# EAGLE design MINI (EAGLE 6.1)
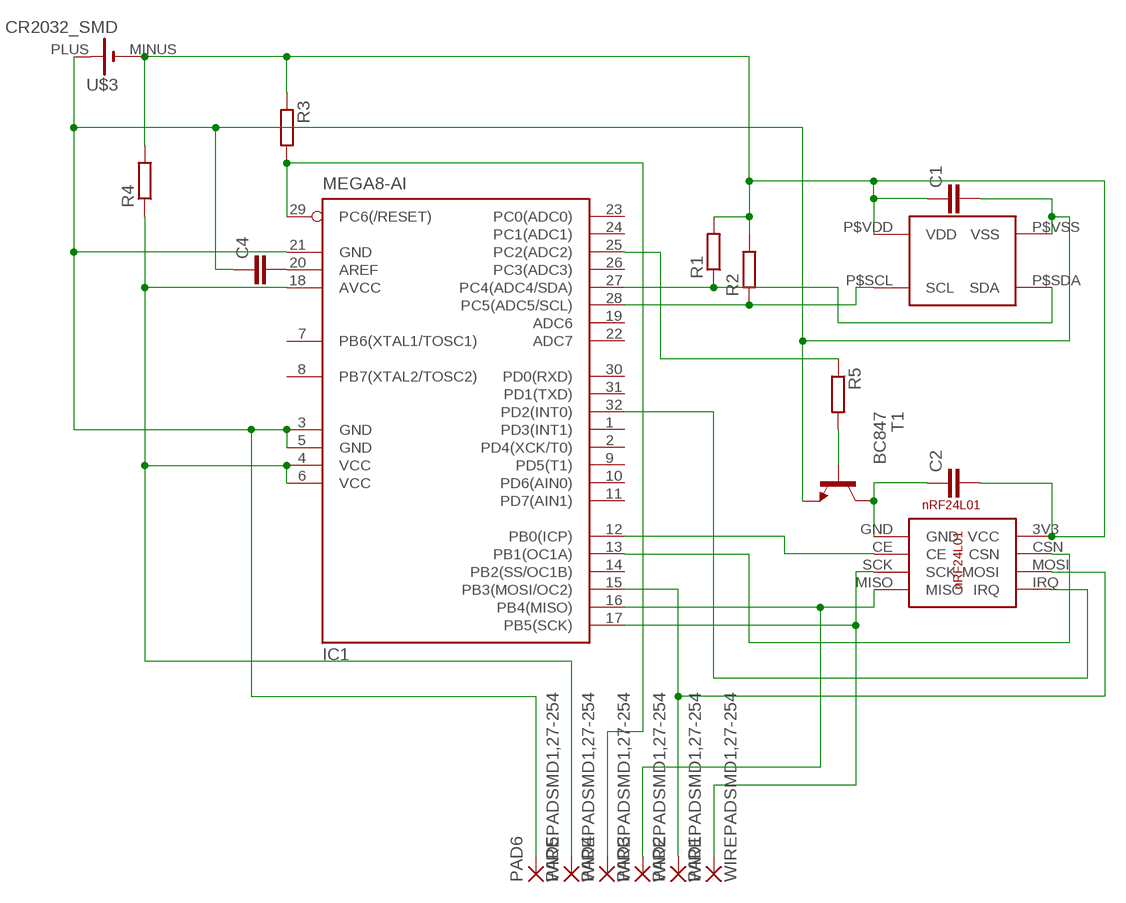
[diagram p0: schematic, sheet 1]

## Parts
C1  C-EUC0805K  [C0805K]
C2  C-EUC0805  [C0805]
C4  C-EUC0805  [C0805]
IC1  MEGA8-AI  [TQFP32-08]
MINI1  NRF24L01BMINI  [MINI]
PAD1  WIREPADSMD1,27-254  [SMD1,27-2,54]
PAD2  WIREPADSMD1,27-254  [SMD1,27-2,54]
PAD3  WIREPADSMD1,27-254  [SMD1,27-2,54]
PAD4  WIREPADSMD1,27-254  [SMD1,27-2,54]
PAD5  WIREPADSMD1,27-254  [SMD1,27-2,54]
PAD6  WIREPADSMD1,27-254  [SMD1,27-2,54]
R1  R-EU_R1206W  [R1206W]
R2  R-EU_R1206W  [R1206W]
R3  R-EU_R0805  [R0805]
R4  R-EU_R1206  [R1206]
R5  R-EU_R0805W  [R0805W]
T1  BC847  [SOT23]
U$1  SHT21  [DFN6]
U$3  CR2032_SMD  [CR2032_SMD]

## Nets
N$1: IC1.32(PD2(INT0)) MINI1.IRQ
N$2: IC1.15(PB3(MOSI/OC2)) MINI1.MOSI PAD2.1(P)
N$3: IC1.17(PB5(SCK)) MINI1.SCK PAD1.1(P)
N$4: IC1.16(PB4(MISO)) MINI1.MISO PAD3.1(P)
N$5: IC1.12(PB0(ICP)) MINI1.CE
N$6: IC1.13(PB1(OC1A)) MINI1.CSN
N$7: IC1.28(PC5(ADC5/SCL)) R2.1 U$1.P$SCL(SCL)
N$8: IC1.27(PC4(ADC4/SDA)) R1.1 U$1.P$SDA(SDA)
N$9: IC1.4(VCC) IC1.6(VCC) IC1.18(AVCC) PAD5.1(P) R4.1
N$10: C2.1 MINI1.GND T1.3(C)
N$11: C4.2 IC1.20(AREF)
N$12: C1.2 C4.1 IC1.3(GND) IC1.5(GND) IC1.21(GND) PAD6.1(P) T1.2(E) U$1.P$VSS(VSS) U$3.PLUS(+)
N$13: IC1.25(PC2(ADC2)) R5.1
N$14: C1.1 C2.2 MINI1.3V3(VCC) R1.2 R2.2 R3.1 R4.2 U$1.P$VDD(VDD) U$3.MINUS(-)
N$17: IC1.29(PC6(/RESET)) PAD4.1(P) R3.2
N$18: R5.2 T1.1(B)
Unconnected: IC1.1(PD3(INT1)) IC1.2(PD4(XCK/T0)) IC1.7(PB6(XTAL1/TOSC1)) IC1.8(PB7(XTAL2/TOSC2)) IC1.9(PD5(T1)) IC1.10(PD6(AIN0)) IC1.11(PD7(AIN1)) IC1.14(PB2(SS/OC1B)) IC1.19(ADC6) IC1.22(ADC7) IC1.23(PC0(ADC0)) IC1.24(PC1(ADC1)) IC1.26(PC3(ADC3)) IC1.30(PD0(RXD)) IC1.31(PD1(TXD))

## Library data of the parts
C1 C2 C4 = resistor:C-EU: CAPACITOR, European symbol
IC1 = atmel:MEGA8: MICROCONTROLLER 8 Kbytes FLASH, 1 kbytes SRAM, 512 bytes EEPROM, USART, 6-channel 10 bit ADC, 2-channel 8 bit ADC Pin compatible with Atmega48, ATMega88, ATMega168 Source: avr.lbr; MPN: ATMEGA8-16AU; OC_FARNELL: 9171371; OC_NEWARK: 73M8863
MINI1 = nRF24L01:NRF24L01B
PAD1-PAD6 = wirepad:WIREPAD: Wire PAD connect wire on PCB
R1-R5 = resistor:R-EU_: RESISTOR, European symbol
T1 = transistor:BC847: NPN TRANSISTOR
U$1 = SHT21:SHT21
U$3 = battery:CR2032_SMD

## Board
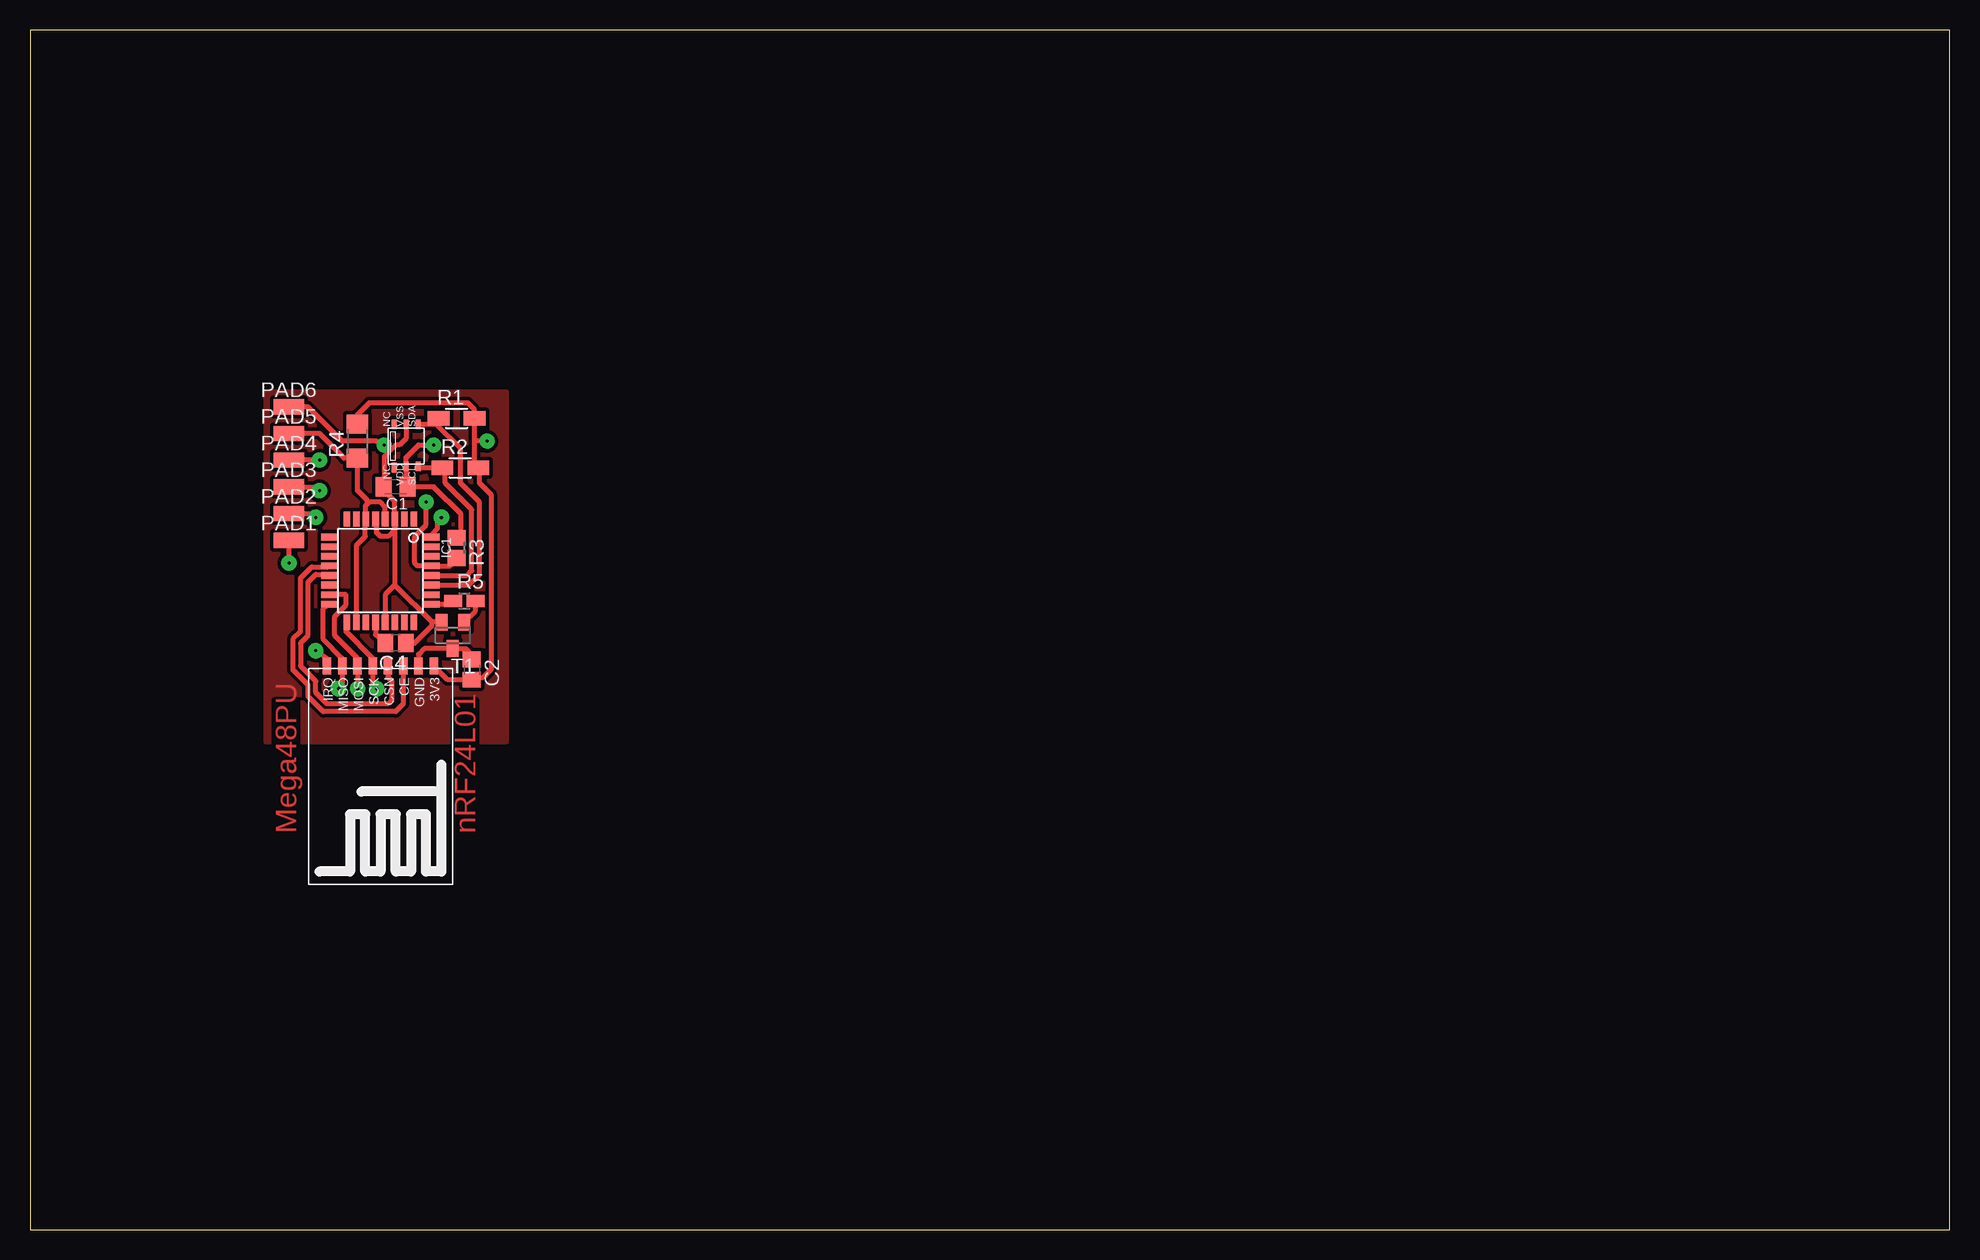
[diagram p1: board, top side]
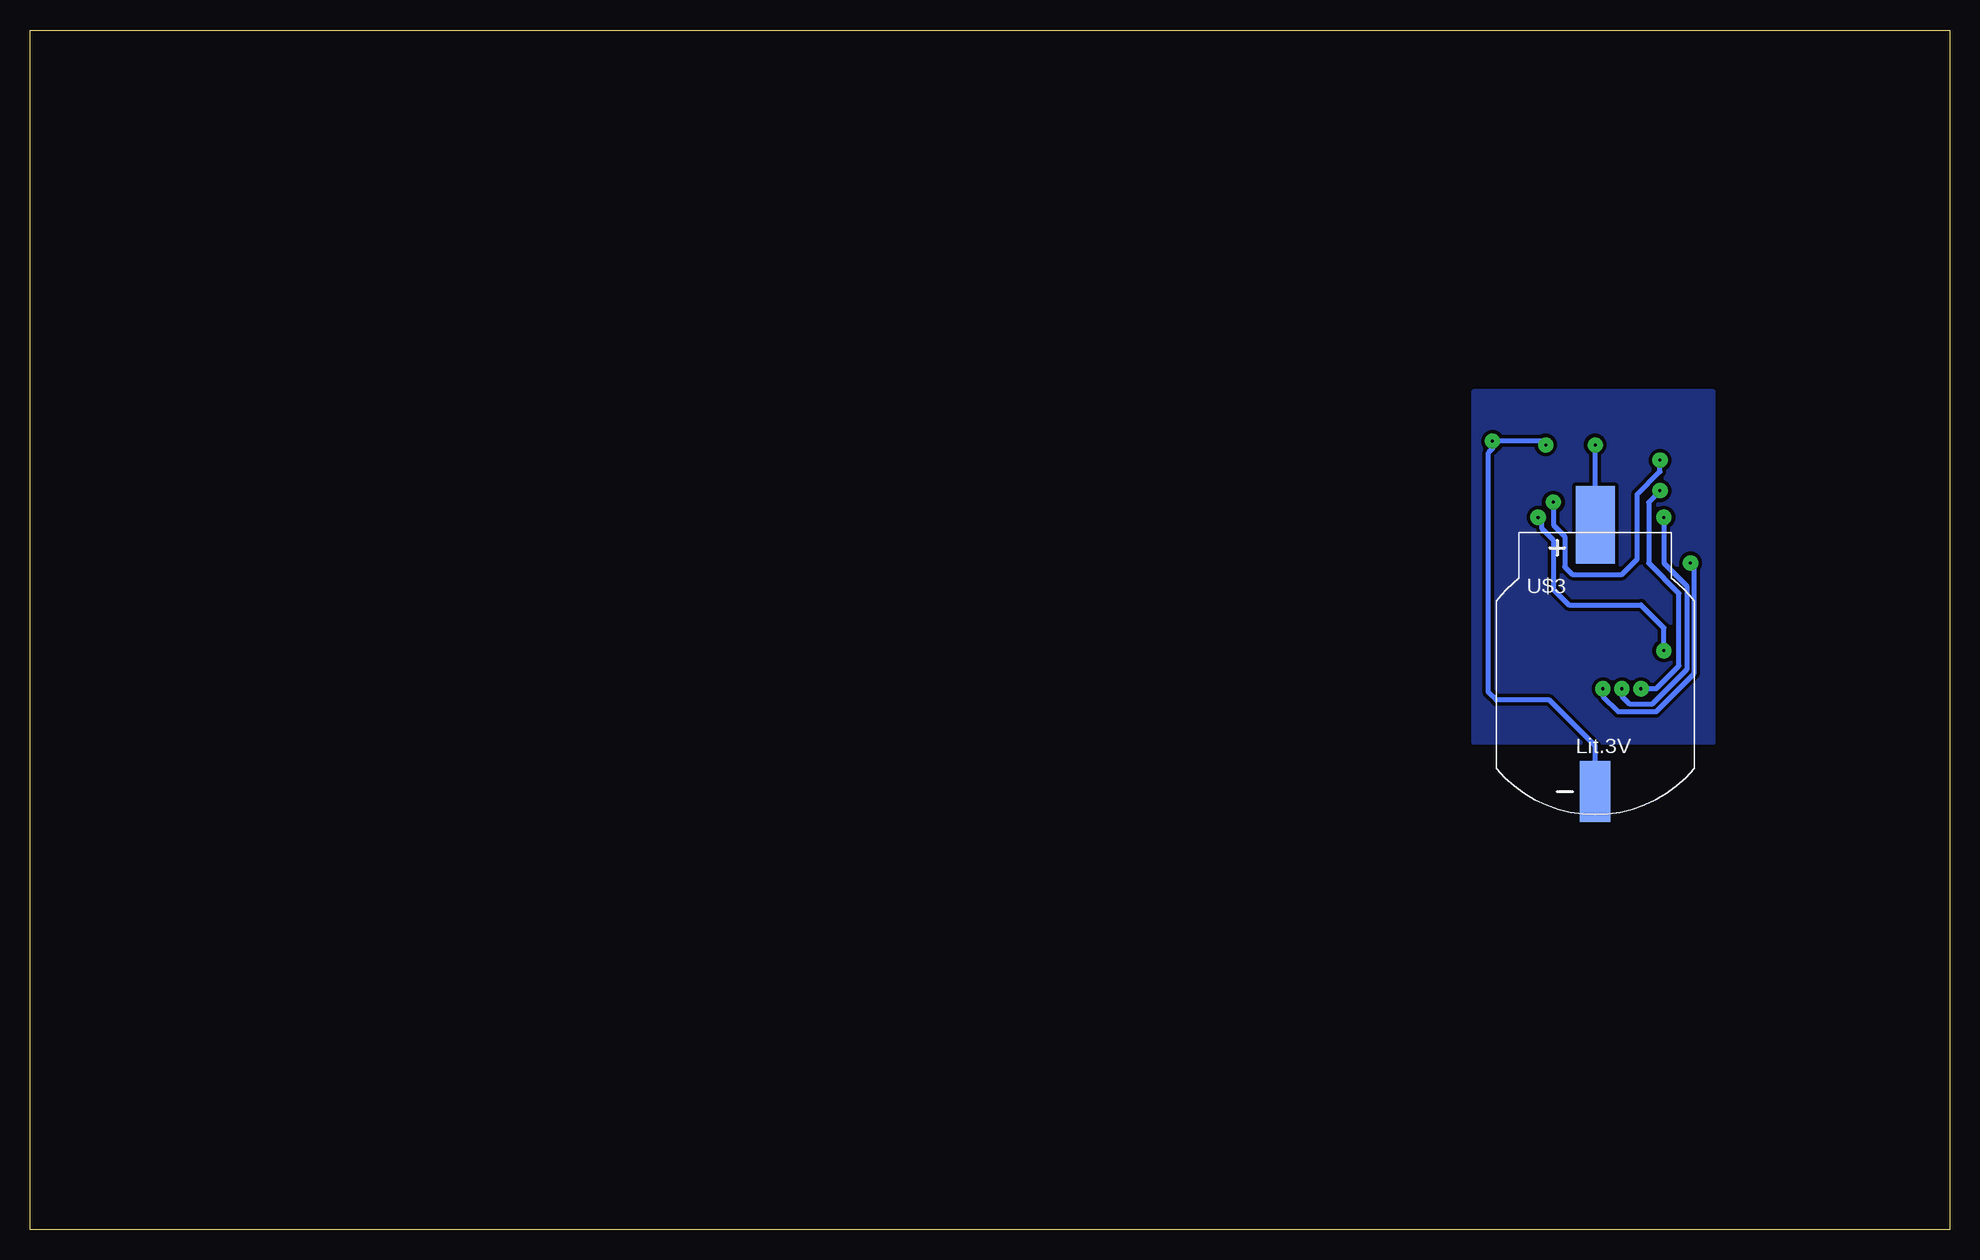
[diagram p2: board, bottom side, seen from below]

Size 160 x 100 mm. Coordinates in mm from the lower left corner, seen from the top.
Outline: 0,0 160,0 160,100 0,100 0,0
Copper layers (1*16): Top 0.035mm / dielectric 1.5mm / Bottom 0.035mm
Design rules: minimum track width 10mil, minimum drill 24mil, track to track 8mil, track to pad 8mil, pad to pad 8mil, via to via 8mil, smd to smd 8mil, copper to edge 40mil, drill to drill 8mil, minimum pad ring 10mil, minimum via ring 8mil, stop-mask expansion 4mil, vias tented up to drill 0mil, thermal gap 10mil

### Footprints (pad centres in the part's own frame; a part is rotated, then mirrored left to right if it is on the bottom)
C0805K = smd 1.3 x 1.6: 1 -1,0; 2 1,0
C0805 = smd 1.3 x 1.5: 1 -0.85,0; 2 0.85,0
TQFP32-08 = smd 1.27 x 0.559: 1 -4.293,2.8; 2 -4.293,2; 3 -4.293,1.2; 4 -4.293,0.4; 5 -4.293,-0.4; 6 -4.293,-1.2; 7 -4.293,-2; 8 -4.293,-2.8; 17 4.293,-2.8; 18 4.293,-2; 19 4.293,-1.2; 20 4.293,-0.4; 21 4.293,0.4; 22 4.293,1.2; 23 4.293,2; 24 4.293,2.8 | smd 0.559 x 1.27: 9 -2.8,-4.293; 10 -2,-4.293; 11 -1.2,-4.293; 12 -0.4,-4.293; 13 0.4,-4.293; 14 1.2,-4.293; 15 2,-4.293; 16 2.8,-4.293; 25 2.8,4.293; 26 2,4.293; 27 1.2,4.293; 28 0.4,4.293; 29 -0.4,4.293; 30 -1.2,4.293; 31 -2,4.293; 32 -2.8,4.293
MINI = smd 1.422 x 0.711: 3V3 -9.207,4.445; CE -9.207,1.905; CSN -9.207,0.635; GND -9.207,3.175; IRQ -9.207,-4.445; MISO -9.207,-3.175; MOSI -9.207,-1.905; SCK -9.207,-0.635
SMD1,27-2,54 = smd 1.27 x 2.54: 1 0,0
R1206W = smd 1.8 x 1.2: 1 -1.499,0; 2 1.499,0
R0805 = smd 1.3 x 1.5: 1 -0.85,0; 2 0.85,0
R1206 = smd 1.6 x 1.803: 1 -1.422,0; 2 1.422,0
R0805W = smd 1.5 x 1: 1 -0.94,0; 2 0.94,0
SOT23 = smd 1 x 1.4: 1 -0.95,-1.1; 2 0.95,-1.1; 3 0,1.1
DFN6 = smd 0.813 x 0.406: P$NC1 -0.3,-0.5; P$NC2 3.3,-0.5; P$SCL -0.2,-2.5; P$SDA 3.3,-2.5; P$VDD -0.2,-1.5; P$VSS 3.3,-1.5
CR2032_SMD = smd 2.54 x 5.08: MINUS 0,-8.89 | smd 3.251 x 6.452: PLUS 0,13.335

### Placement (x,y rotation side)
C1  30.48,61.91 180 top
C2  36.83,46.67 270 top
C4  30.48,48.9 180 top
IC1  29.21,54.93 270 top
MINI1  29.21,37.78 270 top
PAD1  21.59,57.47 270 top
PAD2  21.59,59.69 270 top
PAD3  21.59,61.91 270 top
PAD4  21.59,64.14 270 top
PAD5  21.59,66.36 270 top
PAD6  21.59,68.58 270 top
R1  35.56,67.63 0 top
R2  35.88,63.5 0 top
R3  35.56,56.83 270 top
R4  27.3,65.72 90 top
R5  36.2,52.39 0 top
T1  35.24,49.53 180 top
U$1  29.84,63.82 90 top
U$3  29.53,45.4 0 bottom

### Tracks (layer width: path | path; a pad name or v marks a point on that pad's centre or on a via)
N$1  (via drill 0.25 pad 1.27)
  Top 0.406: MINI1.IRQ 24.77,47.62 v23.81,48.26 | IC1.32 33.5,57.95 33.97,58.42 33.97,59.05 v34.29,59.37
  Bottom 0.406: v23.81,48.26 23.81,50.16 25.72,52.07 31.75,52.07 33.02,53.34 33.02,57.47 33.97,58.42 33.97,59.05 v34.29,59.37
N$2  (via drill 0.25 pad 1.27)
  Top 0.406: IC1.15 26.35,52.93 26.35,52.07 25.4,51.12 25.4,49.53 27.3,47.62 MINI1.MOSI v27.3,45.09 | PAD2.1 23.5,59.69 v23.81,59.37
  Bottom 0.406: v27.3,45.09 27.3,44.45 26.67,43.81 24.77,43.81 21.91,46.67 21.91,53.66 23.81,55.56 v23.81,59.37
N$3  (via drill 0.25 pad 1.27)
  Top 0.406: IC1.17 26.35,50.58 26.35,49.85 28.57,47.62 MINI1.SCK 28.57,45.4 v28.89,45.09 | v21.59,55.56 PAD1.1
  Bottom 0.406: v28.89,45.09 28.89,44.45 27.62,43.18 24.45,43.18 21.27,46.35 21.27,55.24 v21.59,55.56
N$4  (via drill 0.25 pad 1.27)
  Top 0.406: IC1.16 24.86,52.07 24.77,52.07 24.45,51.75 24.45,49.21 26.04,47.62 MINI1.MISO 26.04,45.4 v25.72,45.09 | PAD3.1 23.81,61.91 v24.13,61.59
  Bottom 0.406: v25.72,45.09 24.45,45.09 22.54,46.99 22.54,53.02 25.08,55.56 25.08,60.64 v24.13,61.59
N$5
  Top 0.406: IC1.12 24.84,55.24 23.5,55.24 22.54,54.29 22.54,49.85 21.91,49.21 21.91,46.67 23.18,45.4 23.18,44.45 24.45,43.18 30.48,43.18 31.11,43.81 MINI1.CE
N$6
  Top 0.406: IC1.13 24.84,54.61 23.81,54.61 23.18,53.98 23.18,49.53 22.54,48.9 22.54,46.99 23.81,45.72 23.81,44.77 24.77,43.81 29.84,43.81 30.16,44.13 30.16,45.72 29.84,46.04 MINI1.CSN
N$7
  Top 0.406: IC1.28 36.43,54.53 36.83,54.93 36.83,60.01 34.61,62.23 34.61,63.5 R2.1 32.46,63.5 U$1.P$SCL
N$8
  Top 0.406: IC1.27 36.58,53.73 37.47,54.61 37.47,60.64 35.88,62.23 35.88,65.09 33.85,67.12 | 33.85,67.12 U$1.P$SDA | R1.1 33.85,67.41 33.85,67.12
N$9
  Top 0.406: IC1.4 29.61,60.24 29.21,60.64 28.26,60.64 | 28.26,60.64 27.94,60.33 27.94,59.15 | IC1.18 27.21,57.05 27.94,57.78 27.94,59.15 | 27.94,59.15 IC1.6 | 28.26,60.64 28.11,60.64 28.11,60.79 27.3,61.59 R4.1 26.19,64.3 24.13,66.36 PAD5.1
N$10
  Top 0.406: MINI1.GND 32.38,47.94 32.87,48.43 T1.3 36.34,48.43 36.83,47.94 C2.1
N$11
  Top 0.406: IC1.20 28.81,49.56 C4.2
N$12  (via drill 0.25 pad 1.27)
  Top 0.406: IC1.3 30.41,58.35 29.84,57.78 29.21,57.78 28.89,58.1 28.89,59.14 IC1.5 | IC1.3 30.41,53.73 | 30.41,53.73 33.51,50.63 | 30.41,53.73 29.61,52.93 IC1.21 | T1.2 33.51,50.63 | C4.1 32.07,48.9 33.51,50.34 33.51,50.63 | IC1.3 30.41,60.71 29.48,61.64 C1.2 29.53,61.96 29.53,64.45 30.16,65.09 | U$1.P$VSS 31.34,65.95 30.8,65.41 30.48,65.41 30.16,65.09 | 30.16,65.09 29.84,65.09 v29.53,65.41 29.21,65.41 28.89,65.72 26.04,65.72 23.18,68.58 PAD6.1
  Bottom 0.406: U$3.PLUS v29.53,65.41
N$13
  Top 0.406: IC1.25 35.24,52.13 35.24,52.39 R5.1
N$14  (via drill 0.25 pad 1.27)
  Top 0.406: MINI1.3V3 34.82,45.82 C2.2 37.05,46.04 37.78,46.04 38.42,46.67 38.42,61.28 37.47,62.23 37.47,63.41 R2.2 37.06,63.82 37.06,65.72 | 37.06,65.72 R1.2 37.06,68.35 36.51,68.9 28.26,68.9 27.3,67.94 R4.2 | R3.1 35.88,58 35.88,59.69 33.66,61.91 C1.1 31.34,62.05 U$1.P$VDD 31.34,64.36 32.38,65.41 v33.66,65.41 | v38.1,65.72 37.06,65.72
  Bottom 0.406: v33.66,65.41 33.97,65.72 v38.1,65.72 38.1,65.09 38.42,64.77 38.42,44.77 37.78,44.13 33.34,44.13 29.53,40.32 U$3.MINUS
N$15
  pour Top (isolate 0.305): 19.68,69.85 39.69,69.85 39.69,40.64 19.68,40.64
N$16
  pour Bottom (isolate 0.305): 19.68,69.85 39.69,69.85 39.69,40.64 19.68,40.64
N$17  (via drill 0.25 pad 1.27)
  Top 0.406: R3.2 35.56,55.88 35.01,55.33 IC1.29 32.3,55.33 32.07,55.56 32.07,57.78 33.02,58.74 v33.02,60.64 | v24.13,64.14 PAD4.1
  Bottom 0.406: v33.02,60.64 33.02,58.74 32.07,57.78 32.07,55.24 31.43,54.61 27.3,54.61 26.04,55.88 26.04,61.28 24.13,63.18 v24.13,64.14
N$18
  Top 0.406: T1.1 37.13,51.57 R5.2

### Text on the board
Top: Mega48PU | nRF24L01